# Altium schematic sheet Relay Circuits.SchDoc
size A
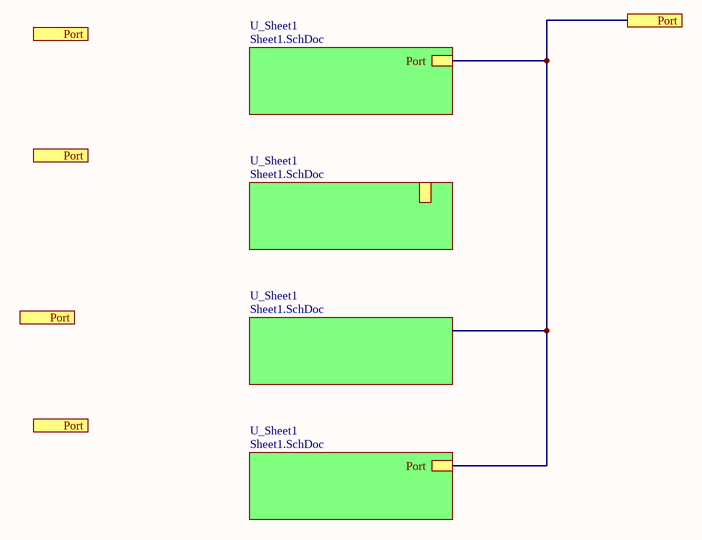
[diagram p0: Relay Circuits.SchDoc]

## Sub-sheets
U_Sheet1 = Sheet1.SchDoc: Port
U_Sheet1 = Sheet1.SchDoc: no entries
U_Sheet1 = Sheet1.SchDoc: no entries
U_Sheet1 = Sheet1.SchDoc: Port

## Ports
Port

## Nets
Port: port Port, sheet U_Sheet1/Port, sheet U_Sheet1/Port